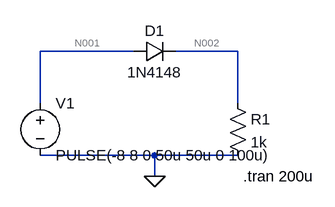
[diagram p0: schematic 1.1.1.asc]
1.1.1.asc, the LTspice schematic file:
Version 4
SHEET 1 880 680
WIRE 224 -16 80 -16
WIRE 384 -16 288 -16
WIRE 80 64 80 -16
WIRE 384 64 384 -16
WIRE 256 144 80 144
WIRE 384 144 256 144
WIRE 256 176 256 144
FLAG 256 176 0
SYMBOL res 368 48 R0
SYMATTR InstName R1
SYMATTR Value 1k
SYMBOL diode 224 0 R270
WINDOW 0 32 32 VTop 2
WINDOW 3 0 32 VBottom 2
SYMATTR InstName D1
SYMATTR Value 1N4148
SYMBOL voltage 80 48 R0
WINDOW 123 0 0 Left 0
WINDOW 39 0 0 Left 0
SYMATTR InstName V1
SYMATTR Value PULSE(-8 8 0 50u 50u 0 100u)
TEXT 392 176 Left 2 !.tran 200u

The netlist it stands for:
* 1.1.1.asc
R1 N002 0 1k
D1 N001 N002 1N4148
V1 N001 0 PULSE(-8 8 0 50u 50u 0 100u)
.model D D
.lib standard.dio
.tran 200u
.backanno
.end

* Results of the author's LTspice run, read from the files saved beside the schematic
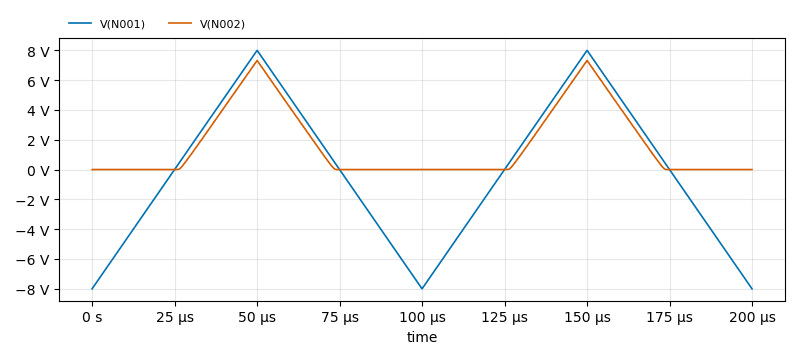
[diagram p1: Transient Analysis of 1.1.1.asc, plotted from the saved traces]
* Transient Analysis, 1 run:
*   V(N001): min -8 V, max 7.994 V, average -1.039 mV, rms 4.761 V, last -8 V
*   V(N002): min -1.307 mV, max 7.315 V, average 1.698 V, rms 3.055 V, last -534 µV